# Altium schematic sheet schemat.SchDoc
size A4
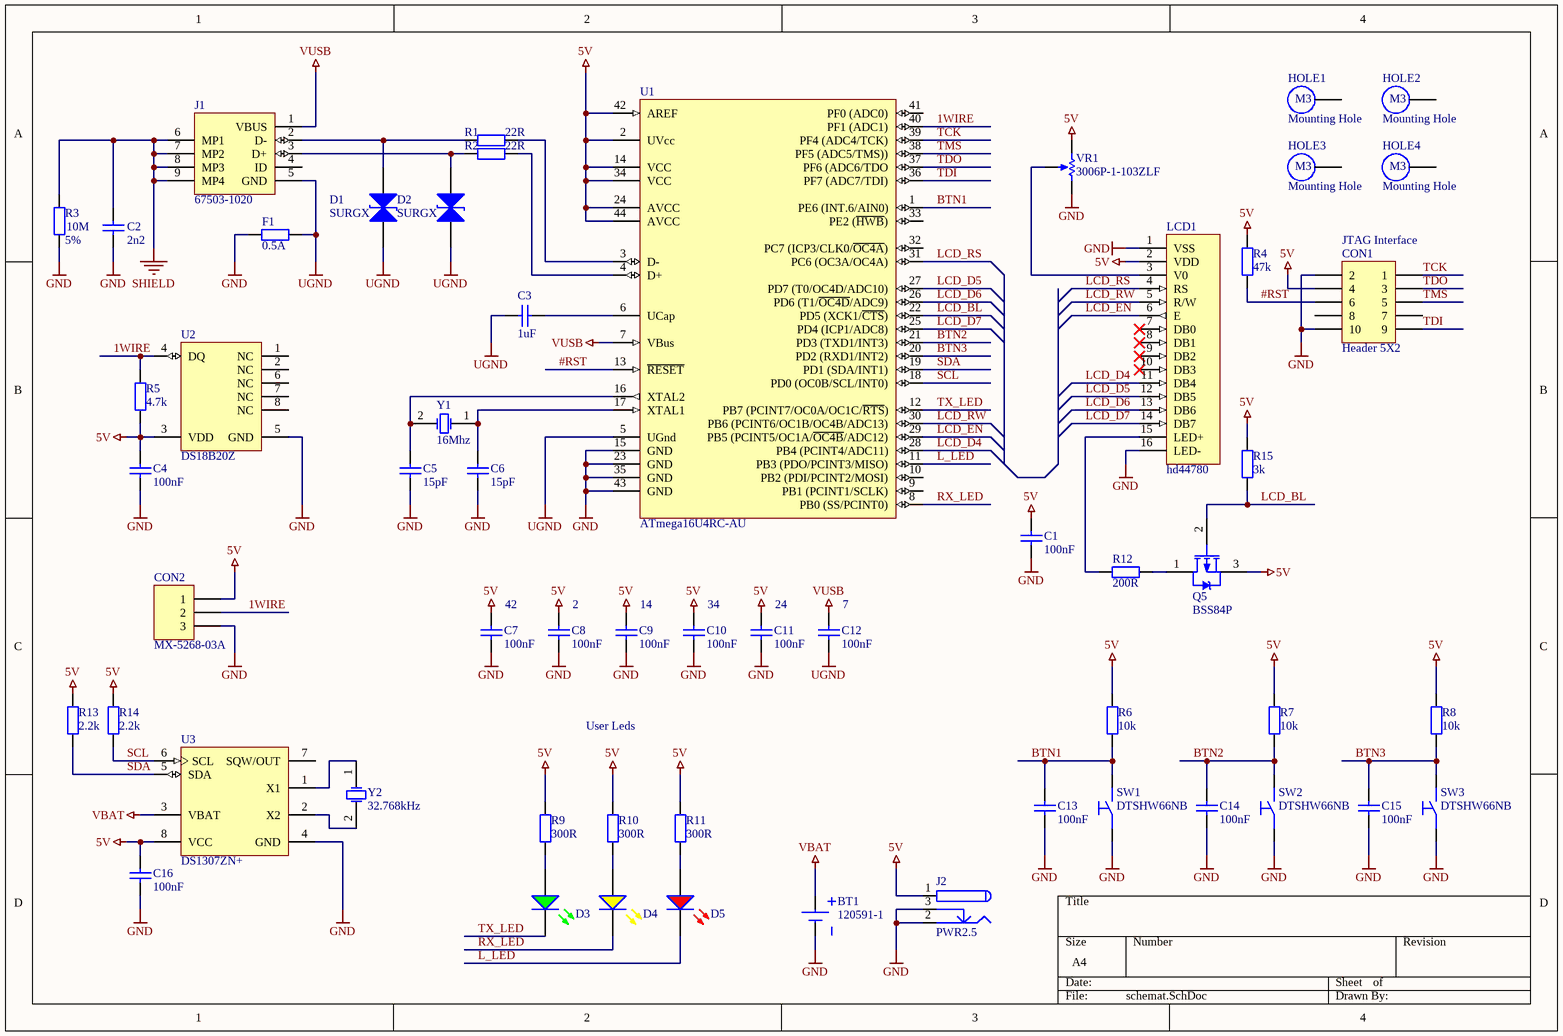
[diagram p0: schemat.SchDoc]

## Parts
BT1  120591-1  [TECO-120591-1-2_V]
C1  100nF  [CAPC1608N]
C2  2n2  [CAPC3216N]
C3  1uF  [CAPC1608N]
C4  100nF  [CAPC1608N]
C5  15pF  [CAPC1608N]
C6  15pF  [CAPC1608N]
C7  100nF  [CAPC1608N]
C8  100nF  [CAPC1608N]
C9  100nF  [CAPC1608N]
C10  100nF  [CAPC1608N]
C11  100nF  [CAPC1608N]
C12  100nF  [CAPC1608N]
C13  100nF  [CAPC1608N]
C14  100nF  [CAPC1608N]
C15  100nF  [CAPC1608N]
C16  100nF  [CAPC1608N]
CON1  Header 5X2  [918510X324]
CON2  MX-5268-03A  [MX-5268-03]
D1  SURGX  [SURGX-0603]
D2  SURGX  [SURGX-0603]
D3  LED_GREEN  [LED 5mm Single Green]  (value not drawn)
D4  LED_YELLOW  [LED 5mm Single Yellow]  (value not drawn)
D5  LED_RED  [LED 5mm Single]  (value not drawn)
F1  0.5A  [SR050]
HOLE1  Mounting Hole  [Hole3.2x6mm]  (no BOM)
HOLE2  Mounting Hole  [Hole3.2x6mm]  (no BOM)
HOLE3  Mounting Hole  [Hole3.2x6mm]  (no BOM)
HOLE4  Mounting Hole  [Hole3.2x6mm]  (no BOM)
J1  67503-1020  [MOLX-67503-1020_V]
J2  PWR2.5  [KLD-0202]
LCD1  hd44780  [hd44780]
Q5  BSS84P  [SOT95P230-3L]
R1  22R  [RESC1608N]
R2  22R  [RESC1608N]
R3  Tolerance: 5%  [RESC3216N]  (hidden comment: 10M)
R4  47k  [RESC1608N]
R5  4.7k  [RESC1608N]
R6  10k  [RESC1608N]
R7  10k  [RESC1608N]
R8  10k  [RESC1608N]
R9  300R  [RESC1608N]
R10  300R  [RESC1608N]
R11  300R  [RESC1608N]
R12  200R  [RESC1608N]
R13  2.2k  [RESC1608N]
R14  2.2k  [RESC1608N]
R15  3k  [RESC1608N]
SW1  DTSHW66NB  [FSM2J]
SW2  DTSHW66NB  [FSM2J]
SW3  DTSHW66NB  [FSM2J]
U1  ATmega16U4RC-AU  [44ML_M]
U2  DS18B20Z  [SO-8_L]
U3  DS1307ZN+  [SO-8_L]
VR1  3006P-1-103ZLF  [BOUR-3006P-3_V]
Y1  16Mhz  [HC-49U]
Y2  32.768kHz  [HC-49U]

## Nets
5V: C1.2 C4.2 C7.2 C8.2 C9.2 C10.2 C11.2 C16.2 CON1.4 CON2.1 J2.1 LCD1.2(VDD) Q5.3(S) R4.2 R5.1 R6.1 R7.1 R8.1 R9.2 R10.2 R11.2 R13.2 R14.2 R15.2 U1.2(UVcc) U1.14(VCC) U1.24(AVCC) U1.34(VCC) U1.42(AREF) U1.44(AVCC) U2.3(VDD) U3.8(VCC) VR1.3(CW)
GND: BT1.2(-) C1.1 C2.1 C4.1 C5.1 C6.1 C7.1 C8.1 C9.1 C10.1 C11.1 C13.1 C14.1 C15.1 C16.1 CON1.2 CON1.10 CON2.3 F1.1 J2.2 J2.3 LCD1.1(VSS) LCD1.16(LED-) R3.1 SW1.1 SW2.1 SW3.1 U1.15(GND) U1.23(GND) U1.35(GND) U1.43(GND) U2.5(GND) U3.4(GND) VR1.1(CCW)
SHIELD: C2.2 J1.6(MP1) J1.7(MP2) J1.8(MP3) J1.9(MP4) R3.2
UGND: C3.1 C12.1 D1.1 D2.1 F1.2 J1.5(GND) U1.5(UGnd)
VBAT: BT1.1(+) U3.3(VBAT)
VUSB: C12.2 J1.1(VBUS) U1.7(VBus)
1WIRE: CON2.2 R5.2 U1.40(PF1_(ADC1)) U2.4(DQ)
#RST: CON1.6 R4.1 U1.13(~{RESET})
BTN1: C13.2 R6.2 SW1.2 U1.1(PE6_(INT.6/AIN0))
BTN2: C14.2 R7.2 SW2.2 U1.21(PD3_(TXD1/INT3))
BTN3: C15.2 R8.2 SW3.2 U1.20(PD2_(RXD1/INT2))
L_LED: D5.2(K) U1.11(PB3_(PDO/PCINT3/MISO))
LCD_BL: Q5.2(G) R15.1 U1.22(PD5_(XCK1/~{CTS}))
LCD_D4: LCD1.11(DB4) U1.28(PB4_(PCINT4/ADC11))
LCD_D5: LCD1.12(DB5) U1.27(PD7_(T0/OC4D/ADC10))
LCD_D6: LCD1.13(DB6) U1.26(PD6_(T1/~{OC4D}/ADC9))
LCD_D7: LCD1.14(DB7) U1.25(PD4_(ICP1/ADC8))
LCD_EN: LCD1.6(E) U1.29(PB5_(PCINT5/OC1A/~{OC4B}/ADC12))
LCD_RS: LCD1.4(RS) U1.31(PC6_(OC3A/OC4A))
LCD_RW: LCD1.5(R/W) U1.30(PB6_(PCINT6/OC1B/OC4B/ADC13))
RX_LED: D4.2(K) U1.8(PB0_(SS/PCINT0))
SCL: R14.1 U1.18(PD0_(OC0B/SCL/INT0)) U3.6(SCL)
SDA: R13.1 U1.19(PD1_(SDA/INT1)) U3.5(SDA)
TCK: CON1.1 U1.39(PF4_(ADC4/TCK))
TDI: CON1.9 U1.36(PF7_(ADC7/TDI))
TDO: CON1.3 U1.37(PF6_(ADC6/TDO)
TMS: CON1.5 U1.38(PF5_(ADC5/TMS)))
TX_LED: D3.2(K) U1.12(PB7_(PCINT7/OC0A/OC1C/~{RTS}))
NetC3_2: C3.2 U1.6(UCap)
NetC5_2: C5.2 U1.16(XTAL2) Y1.2(OSC2)
NetC6_2: C6.2 U1.17(XTAL1) Y1.1(OSC1)
NetD1_2: D1.2 J1.2(D-) R1.1
NetD2_2: D2.2 J1.3(D+) R2.1
NetD3_1: D3.1(A) R9.1
NetD4_1: D4.1(A) R10.1
NetD5_1: D5.1(A) R11.1
NetLCD1_3: LCD1.3(V0) VR1.2(WIPER)
NetLCD1_15: LCD1.15(LED+) R12.1
NetQ5_1: Q5.1(D) R12.2
NetR1_2: R1.2 U1.3(D-)
NetR2_2: R2.2 U1.4(D+)
NetU3_1: U3.1(X1) Y2.1(OSC1)
NetU3_2: U3.2(X2) Y2.2(OSC2)

Not connected (* = marked no-connect by the designer): CON1 7 8; HOLE1 0; HOLE2 0; HOLE3 0; HOLE4 0; J1 4(ID); LCD1 7(DB0)* 8(DB1)* 9(DB2)* 10(DB3)*; U1 9(PB1_(PCINT1/SCLK)) 10(PB2_(PDI/PCINT2/MOSI)) 32(PC7_(ICP3/CLK0/~{OC4A})) 33(PE2_(~{HWB})) 41(PF0_(ADC0)); U2 1(NC) 2(NC) 6(NC) 7(NC) 8(NC); U3 7(SQW/OUT)

## Notes on the sheet
- (near CON1) JTAG Interface
- (near C7) 42
- (near C8) 2
- (near C9) 14
- (near C10) 34
- (near C11) 24
- (near C12) 7
- User Leds
- (in symbol HOLE M3) M3

## Library data of the parts
BT1 = CMP-0438-00001-1: Lithium Battery Holder for CR2032 3V Cell; Manufacturer: TE Connectivity; Body Shape: Horizontal Cylindrical; Packing Type: Tray; ComponentLink2Description: Datasheet; ComponentLink2URL: http://www.te.com/commerce/DocumentDelivery/DDEController?Action=showdoc&DocId=Customer+Drawing%7F120591%7FH%7Fpdf%7FEnglish%7FENG_CD_120591_H.pdf%7F120591-1; DatasheetVersion: Rev. H, 01/2013; PackageReference: 120591-1; ComponentLink1Description: Manufacturer URL; Mounting Technology: Through Hole; PackageDescription: Lithium Battery Holder; ComponentLink1URL: http://www.te.com/; PartNumber: 120591-1
C1-C16 = Capacitor
  C1 C4 C7-C16: Value: 100nF
  C2: Value: 2n2
  C3: Value: 1uF
  C5 C6: Value: 15pF
CON1 = Header 5X2: Header, 5-Pin, Dual row; LatestRevisionDate: 17-Jul-2002; LatestRevisionNote: Re-released for DXP Platform.; Publisher: Altium Limited
CON2 = Header 3: Header, 3-Pin; LatestRevisionDate: 17-Jul-2002; LatestRevisionNote: Re-released for DXP Platform.; Publisher: Altium Limited
D1 D2 = SURGX: ESD Suppressor; ComponentLink1Description: Manufacturer Link; ComponentLink2Description: Datasheet; Distributor: tme.pl
F1 = SR050: value: 0.5A
HOLE1-HOLE4 = HOLE M3
J1 = CMP-0411-00002-1: USB, MINI, SMD, RA KME04-USBMU03A01; Manufacturer: Molex; ComponentLink1URL: http://www.molex.com/; PartNumber: 67503-1020; Mounting Technology: Surface Mount; ComponentLink1Description: Manufacturer URL; Terminal Pitch: 0.8 mm; DatasheetVersion: Rev F, 06/2009; ComponentLink2Description: Datasheet; PackageDescription: Mini USB Connector, SMT, Righer Angle; ComponentLink2URL: http://www.molex.com/pdm_docs/sd/675031020_sd.pdf; PackageReference: 67503-1020
J2 = PWR2.5: Low Voltage Power Supply Connector; Published: 17-Dec-2003; DatasheetDocument: 09-May-2002; Publisher: Altium Limited; ComponentLink1Description: Manufacturer Link; ComponentLink1URL: http://domino.kycon.com/internet/Products.html
Q5 = AP2301AGN
R1 R2 R4-R15 = Resistor: Tolerance: 5%; Power: 0W
  R1 R2: Value: 22R
  R4: Value: 47k
  R5: Value: 4.7k
  R6-R8: Value: 10k
  R9-R11: Value: 300R
  R12: Value: 200R
  R13 R14: Value: 2.2k
  R15: Value: 3k
R3 = Resistor: Power: 0W; Value: 10M
SW1-SW3 = DTSHW66NB: SWITCH, SPNO TACT; Published: 8-Jun-2000; LatestRevisionDate: 17-Jul-2002; LatestRevisionNote: Re-released for DXP Platform.; PackageDocument: Sep-1998; PackageReference: SOT-23A; Publisher: Altium Limited; ComponentLink1Description: Manufacturer Link; ComponentLink2Description: Datasheet; Distributor: tme.pl; tme.pl: DTSHW66NB
U1 = CMP-0095-00572-1: 8-bit AVR Microcontroller, 2.7-5.5V, 16MHz, 16KB Flash, 512 Bytes EEPROM, 1.25KB SRAM, USB Controller, 44-pin TQFP, Industrial Grade (-40°C to 85°C), Int RC; PackageReference: 44ML; DatasheetVersion: revF, Nov-2010; PackageDescription: 44-Pin Plastic Thin Quad Flat Pack, 10 x 10 x 1.0 mm Body, 0.8 mm Pitch (TQFP); ComponentLink1Description: Manufacturer URL; ComponentLink1URL: http://www.atmel.com/; ComponentLink3URL: http://www.atmel.com/dyn/resources/prod_documents/7766S.pdf; ComponentLink2Description: ATmega16U4/32U4 Datasheet; ComponentLink2URL: http://www.atmel.com/dyn/resources/prod_documents/doc7766.pdf; PackageVersion: rev.G, Jul-2007; ComponentLink3Description: ATmega16U4 ATmega32U4 Summary
U2 = CMP-0253-00023-2: High-Precision 1-Wire Digital Thermometer, -55 to 125 degC, 8-Pin SOIC (S8-2); Parasite Pwr.: Yes; Temp. Thresh.: Programmable (NV); Sensor Type: Local; Code_JEDEC: MS012; Mounting Technology: Surface Mount; ComponentLink3Description: Package Specification; PartNumber: DS18B20Z; ComponentLink2Description: Datasheet; ComponentLink3URL: http://pdfserv.maximintegrated.com/package_dwgs/21-0041.PDF; PackageVersion: Rev. D, 10/2012; ComponentLink1URL: http://www.maximintegrated.com/; Multi Droppable: Yes; ComponentLink1Description: Manufacturer URL; ComponentLink2URL: http://datasheets.maximintegrated.com/en/ds/DS18B20.pdf; Generic Part Number: DS18B20; PackageReference: S8-2; PackageDescription: 8-Pin Small-Outline IC, Narrow (0.15in) (S8-2), Body 4.90 x 3.90 mm, Pitch 1.27 mm; Interface: 1-Wire; DatasheetVersion: Rev. 4
U3 = CMP-0254-00324-1: 64 x 8, Serial, I2C Real-Time Clock, 5.0V, 8-Pin SO, -40 to 85 degC, Pb-Free; PackageDescription: 8-Pin Small-Outline IC, Narrow (0.15in), 1.27 mm Pitch, SOIC (N), Pb-Free; PackageVersion: revC, 2010; ComponentLink3URL: http://pdfserv.maxim-ic.com/package_dwgs/21-0041.PDF; Code_IPC: SOIC127P600-8; Code_JEDEC: MS-012-AA; ComponentLink2Description: Datasheet; ComponentLink3Description: Package Specification; PackageReference: S8+2; DatasheetVersion: 10-Feb-2008; ComponentLink2URL: http://datasheets.maxim-ic.com/en/ds/DS1307.pdf; ComponentLink1Description: Manufacturer URL; ComponentLink1URL: http://www.maxim-ic.com
VR1 = CMP-0975-00014-1: Trimming Potentiometer, 10K Ohm +/- 10%, -55 to 125 degC, 3-Pin 19.05 x 4.83 x 6.6 mm THD, RoHS; Manufacturer: Bourns; Rotational Life: 200 Cycles; Number of Turns: 15; Resistance (kOhm): 10; Resistance Tolerance: +/- 10%; Mounting Technology: Through Hole; PackageDescription: 3-Pin THD, Body 19.05 x 4.83 mm, Height 6.6 mm; ComponentLink2URL: http://www.bourns.com/data/global/pdfs/3006.pdf; PackageVersion: Apr-14; ComponentLink3Description: Package Specification; ComponentLink1Description: Manufacturer URL; DatasheetVersion: Apr-14; RoHS: TRUE; Temperature Range: -55 to 125 degC; PartNumber: 3006P-1-103ZLF; ComponentLink3URL: http://www.bourns.com/data/global/pdfs/3006.pdf; ComponentLink2Description: Datasheet; PackageReference: 3006P-3; ComponentLink1URL: http://www.bourns.com/
Y1 Y2 = XTAL: Crystal Oscillator
  Y1: Value: 16Mhz
  Y2: Value: 32.768kHz
LCD1 = hd44780: LatestRevisionDate: 17-Jul-2002; LatestRevisionNote: Re-released for DXP Platform.; Publisher: Altium Limited